# EAGLE design power_node (EAGLE 6.5.0)
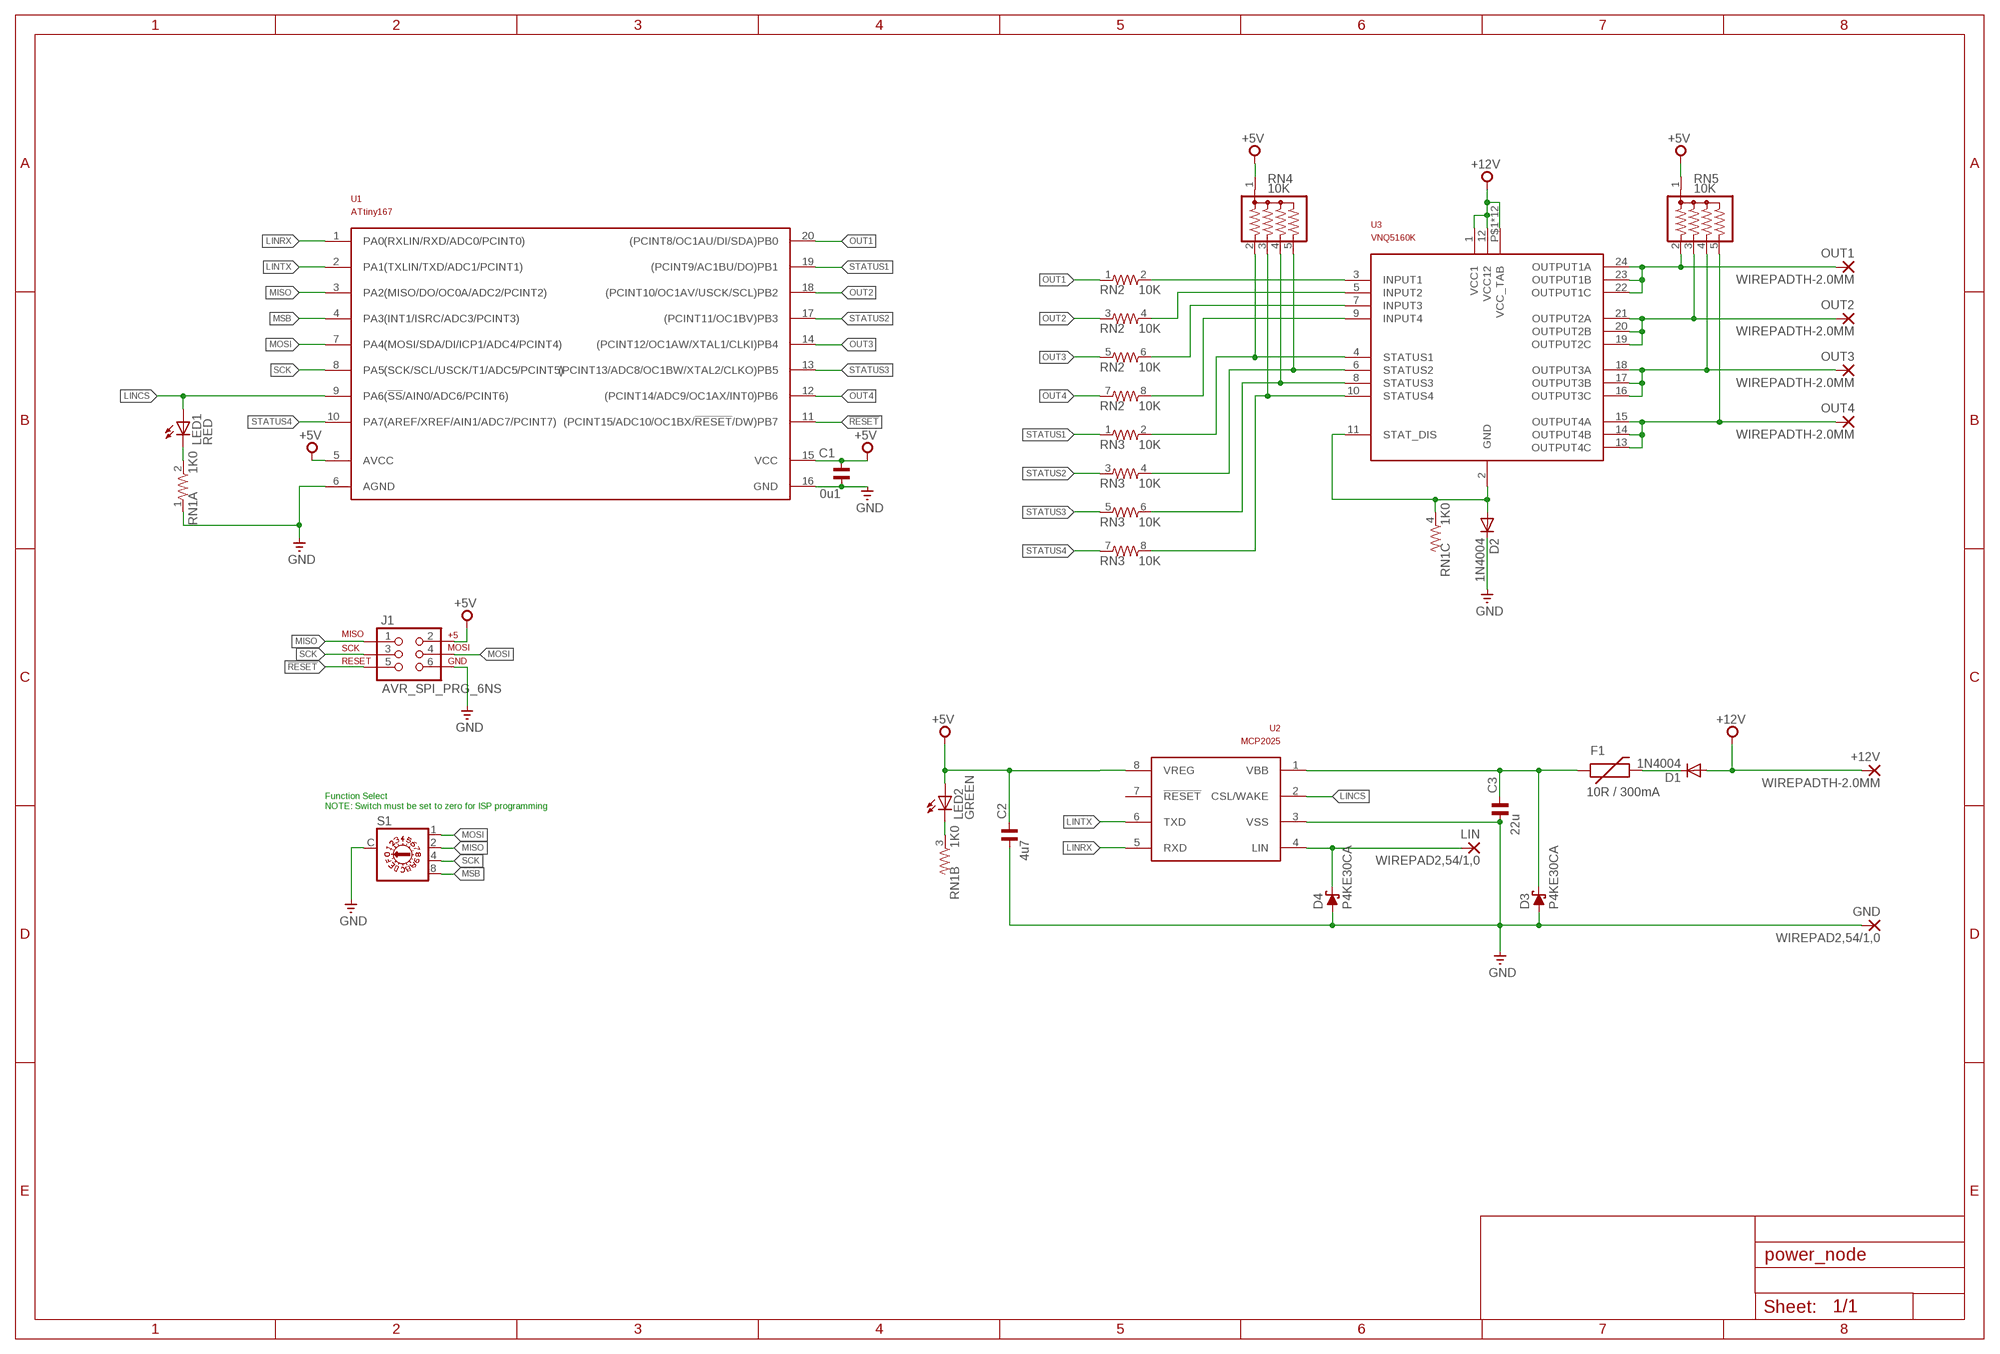
[diagram p0: schematic, sheet 1]

## Parts
+12V  WIREPADTH-2.0MM  [WIREPAD-TH-2.0MM]
C1  0u1  C-EU025-024X044  [C025-024X044]
C2  4u7  C-EU050-024X044  [C050-024X044]
C3  22u  C-EU050-024X044  [C050-024X044]
D1  1N4004  [DO41-10]
D2  1N4004  [DO41-10]
D3  P4KE30CA  P4KEXX  [DO41-10]
D4  P4KE30CA  P4KEXX  [DO41-10]
F1  10R / 300mA  PTCPTH  [PTC]
GND  WIREPAD2,54/1,0  [2,54/1,0]
J1  AVR_SPI_PRG_6NS  [2X3-NS]
LED1  RED  LED3MM  [LED3MM]
LED2  GREEN  LED3MM  [LED3MM]
LIN  WIREPAD2,54/1,0  [2,54/1,0]
OUT1  WIREPADTH-2.0MM  [WIREPAD-TH-2.0MM]
OUT2  WIREPADTH-2.0MM  [WIREPAD-TH-2.0MM]
OUT3  WIREPADTH-2.0MM  [WIREPAD-TH-2.0MM]
OUT4  WIREPADTH-2.0MM  [WIREPAD-TH-2.0MM]
RN1  1K0  GE03R  [SIL4]
RN2  10K  E4RP  [SIL8]
RN3  10K  E4RP  [SIL8]
RN4  10K  G04R  [SIL5]
RN5  10K  G04R  [SIL5]
S1  P103  [P103]
U1  ATtiny167  ATTINY167  [SO20W]
U2  MCP2025  [SO08]
U3  VNQ5160K  [POWERSSO24]

## Nets
!RESET: J1.5 U1.11((PCINT15/ADC10/OC1BX/!RESET!/DW)PB7)
+5V [power]: C1.1 C2.1 J1.2 LED2.A RN4.1 RN5.1 U1.5(AVCC) U1.15(VCC) U2.8(VREG)
+12V [power]: +12V.1(P) D1.A U3.1(VCC1) U3.12(VCC12) U3.P$1(VCC_TAB) U3.P$2(VCC_TAB) U3.P$3(VCC_TAB) U3.P$4(VCC_TAB) U3.P$5(VCC_TAB) U3.P$6(VCC_TAB) U3.P$7(VCC_TAB) U3.P$8(VCC_TAB) U3.P$9(VCC_TAB) U3.P$10(VCC_TAB) U3.P$11(VCC_TAB) U3.P$12(VCC_TAB)
GND [power]: C1.2 C2.2 C3.2 D2.C D3.A D4.A GND.1(P) J1.6 RN1.1 S1.C U1.6(AGND) U1.16(GND) U2.3(VSS)
LINCS: LED1.A U1.9(PA6(!SS!/AIN0/ADC6/PCINT6)) U2.2(CSL/WAKE)
LINRX: U1.1(PA0(RXLIN/RXD/ADC0/PCINT0)) U2.5(RXD)
LINTX: U1.2(PA1(TXLIN/TXD/ADC1/PCINT1)) U2.6(TXD)
MISO: J1.1 S1.2 U1.3(PA2(MISO/DO/OC0A/ADC2/PCINT2))
MOSI: J1.4 S1.1 U1.7(PA4(MOSI/SDA/DI/ICP1/ADC4/PCINT4))
MSB: S1.8 U1.4(PA3(INT1/ISRC/ADC3/PCINT3))
N$1: D4.C LIN.1(P) U2.4(LIN)
N$2 [power]: C3.1 D3.C F1.P$1 U2.1(VBB)
N$3: LED1.K(C) RN1.2
N$4: LED2.K(C) RN1.3
N$5 [power]: D1.C F1.P$2
N$6: RN3.8 RN4.3 U3.10(STATUS4)
N$7: RN3.6 RN4.4 U3.8(STATUS3)
N$8 [power]: D2.A RN1.4 U3.2(GND) U3.11(STAT_DIS)
N$9: RN3.4 RN4.5 U3.6(STATUS2)
N$10: RN3.2 RN4.2 U3.4(STATUS1)
N$11: RN2.2 U3.3(INPUT1)
N$12: RN2.8 U3.9(INPUT4)
N$13: RN2.6 U3.7(INPUT3)
N$14: RN2.4 U3.5(INPUT2)
OUT1: RN2.1 U1.20((PCINT8/OC1AU/DI/SDA)PB0)
OUT2: RN2.3 U1.18((PCINT10/OC1AV/USCK/SCL)PB2)
OUT3: RN2.5 U1.14((PCINT12/OC1AW/XTAL1/CLKI)PB4)
OUT4: RN2.7 U1.12((PCINT14/ADC9/OC1AX/INT0)PB6)
OUTPUT1: OUT1.1(P) RN5.2 U3.22(OUTPUT1C) U3.23(OUTPUT1B) U3.24(OUTPUT1A)
OUTPUT2: OUT2.1(P) RN5.3 U3.19(OUTPUT2C) U3.20(OUTPUT2B) U3.21(OUTPUT2A)
OUTPUT3: OUT3.1(P) RN5.4 U3.16(OUTPUT3C) U3.17(OUTPUT3B) U3.18(OUTPUT3A)
OUTPUT4: OUT4.1(P) RN5.5 U3.13(OUTPUT4C) U3.14(OUTPUT4B) U3.15(OUTPUT4A)
SCK: J1.3 S1.4 U1.8(PA5(SCK/SCL/USCK/T1/ADC5/PCINT5))
STATUS1: RN3.1 U1.19((PCINT9/AC1BU/DO)PB1)
STATUS2: RN3.3 U1.17((PCINT11/OC1BV)PB3)
STATUS3: RN3.5 U1.13((PCINT13/ADC8/OC1BW/XTAL2/CLKO)PB5)
STATUS4: RN3.7 U1.10(PA7(AREF/XREF/AIN1/ADC7/PCINT7))
Unconnected: U2.7(!RESET)

## Notes on the sheet
- Function Select
  NOTE: Switch must be set to zero for ISP programming

## Library data of the parts
+12V GND LIN OUT1-OUT4 = custom:WIREPAD: Wire PAD connect wire on PCB
C1 = custom:C-EU: CAPACITOR, European symbol; PARTNO: FK28X7R1H104K
C2 = custom:C-EU: CAPACITOR, European symbol; PARTNO: FK28X5R0J475K
C3 = custom:C-EU: CAPACITOR, European symbol; PARTNO: FK22X5R1E226M
D1 D2 = custom:1N4004: DIODE general purpose rectifier, 1 A; PARTNO: 1N4004-TP
D3 D4 = custom:P4KEXX: DIODE transient-voltage suppressor; PARTNO: P4KE30CA
F1 = custom:PTC: Resettable Fuse PTC Resettable Fuse. Spark Fun Electronics SKU : COM-08357; PARTNO: 600R150-RBZR
J1 = custom:AVR_SPI_PRG_6: AVR ISP 6 Pin This is the reduced ISP connector for AVR programming. Common on Arduino. This footprint will take up less PCB space and can be used with a 10-pin to 6-pin adapter such as SKU: BOB-08508
LED1 = custom:LED: LEDs Standard schematic elements and footprints for 5mm, 3mm, 1206, and 0603 sized LEDs. 5mm - Spark Fun Electronics SKU : COM-00529 (and others); PARTNO: C4SMF-RJS-CT0W0BB2
LED2 = custom:LED: LEDs Standard schematic elements and footprints for 5mm, 3mm, 1206, and 0603 sized LEDs. 5mm - Spark Fun Electronics SKU : COM-00529 (and others); PARTNO: C4SMF-GJS-CV0Y0792
RN1 = custom:GE03R: SIL RESISTOR; PARTNO: 4604X-101-103LF
RN2 RN3 = custom:E4RP: SIL RESISTOR; PARTNO: 4608X-102-103LF
RN4 RN5 = custom:G04R: SIL RESISTOR; PARTNO: 4605X-101-103LF
S1 = custom:P103: DIL/CODE SWITCH; PARTNO: SH-7050MC
U1 = custom:ATTINY167; PARTNO: ATTINY167-SU
U2 = custom:MCP2025: LIN Transceiver with Voltage Regulator; PARTNO: MCP2025-500E/SN
U3 = custom:VNQ5160K: Quad channel high side driver for automotive applications; PARTNO: VNQ5E160KTR-E

## Net classes
0 default: width 0.381 mm
1 power: width 0.635 mm

## Board
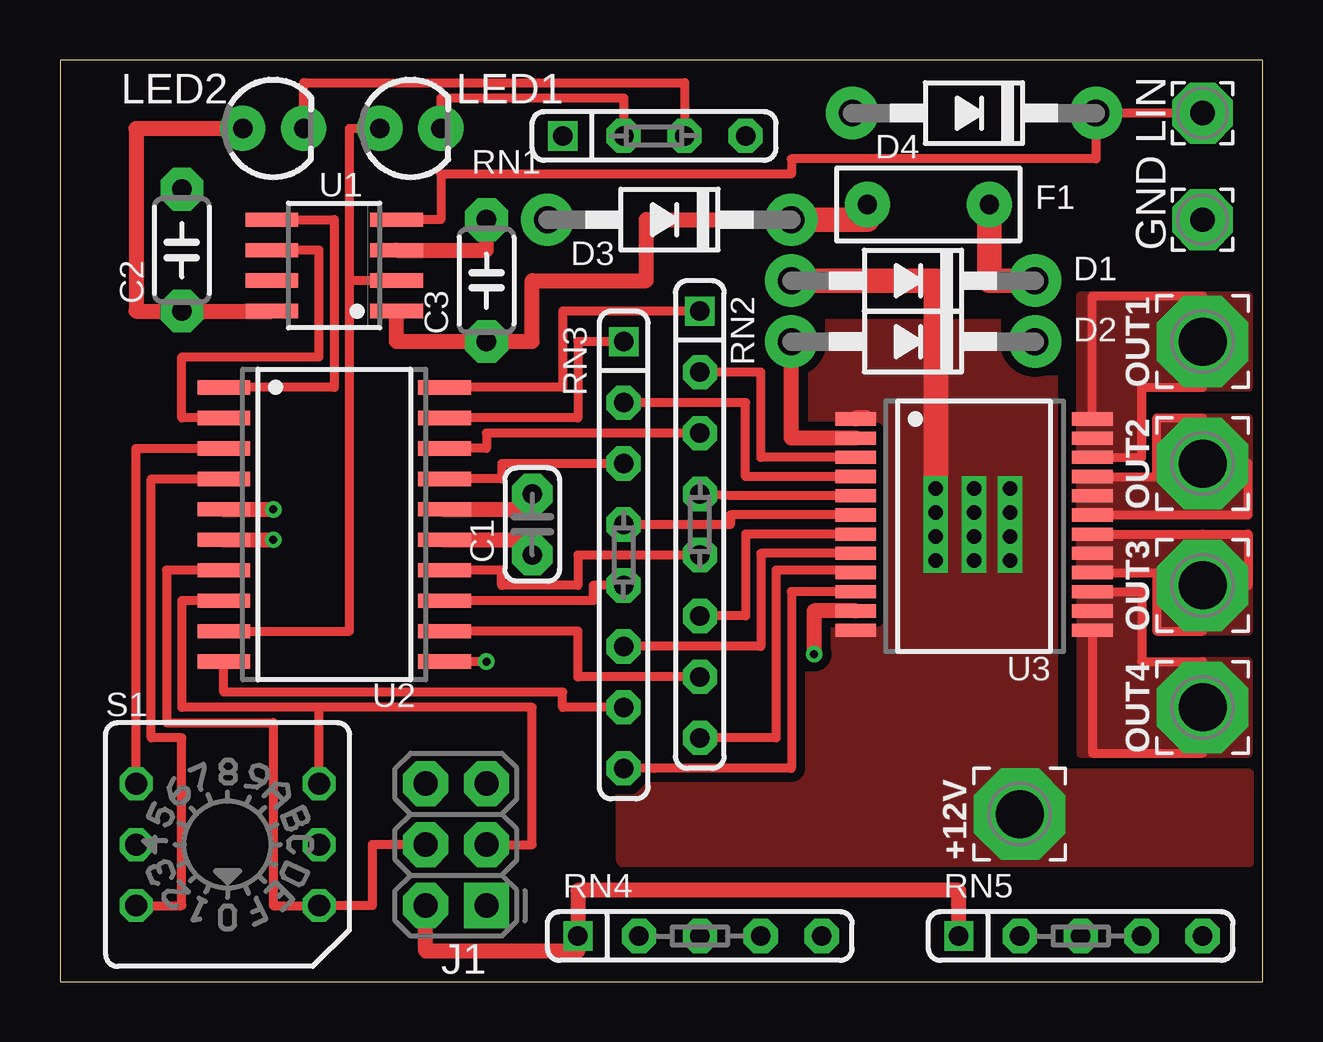
[diagram p1: board, top side]
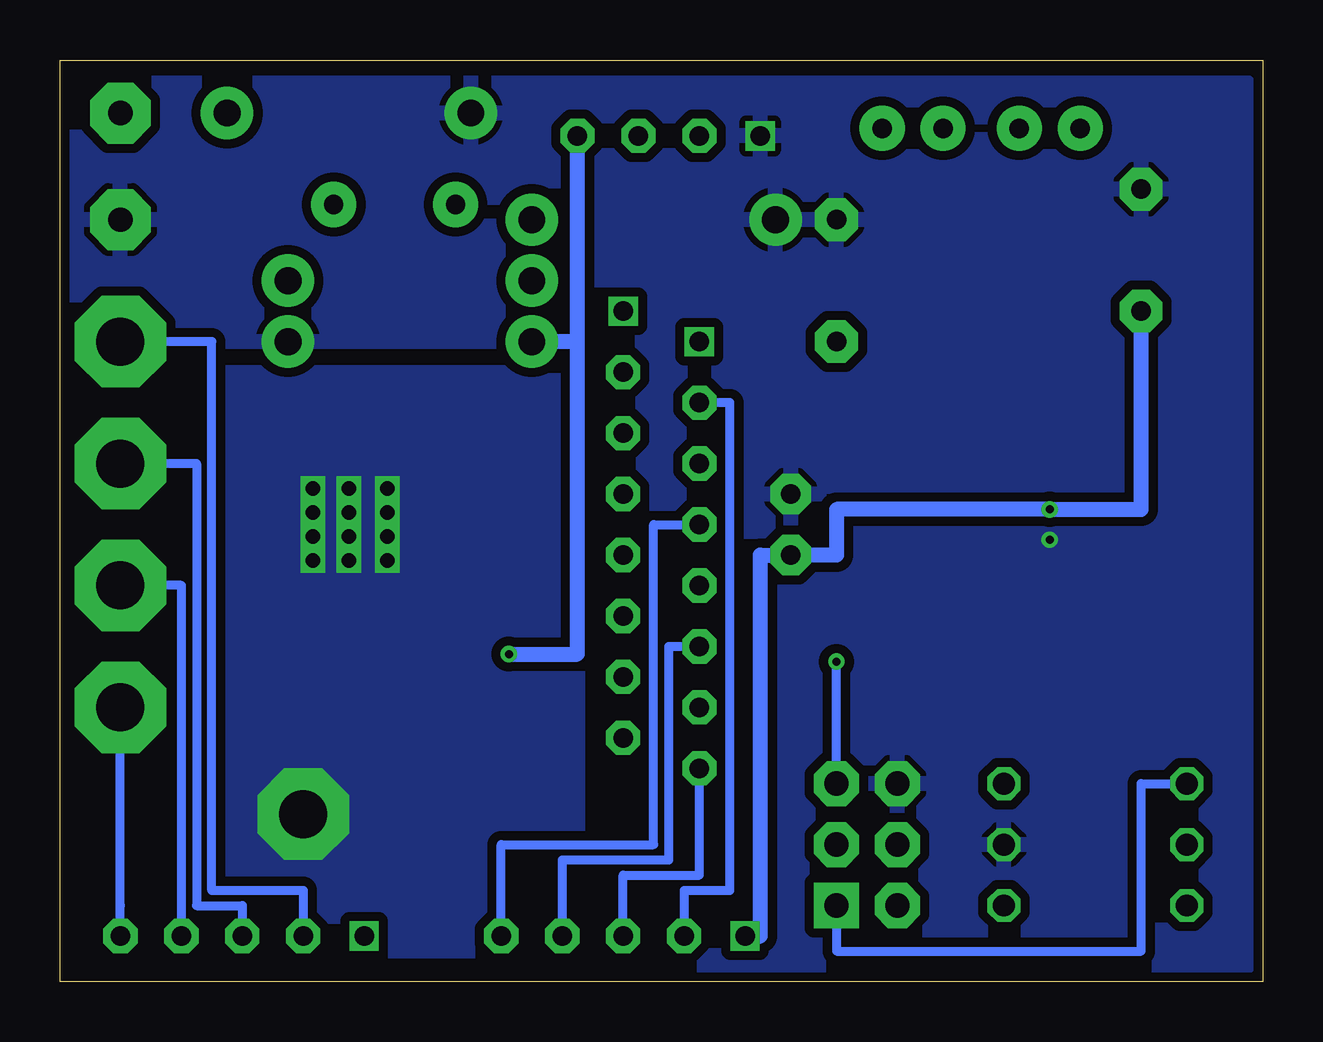
[diagram p2: board, bottom side, seen from below]

Size 50.15 x 38.41 mm. Coordinates in mm from the lower left corner, seen from the top.
Outline: 0,0 50.15,0 50.15,38.41 0,38.41 0,0
Copper layers (1*16): Top 0.0356mm / dielectric 1.5011mm / Bottom 0.0356mm
Design rules "LaenPCBOrder": minimum track width 6mil, minimum drill 13mil, track to track 6mil, track to pad 6mil, pad to pad 6mil, via to via 6mil, smd to smd 6mil, copper to edge 15mil, drill to drill 6mil, minimum pad ring 7mil, minimum via ring 7mil, stop-mask expansion 3mil, vias tented up to drill 0mil, thermal gap 10mil

### Footprints (pad centres in the part's own frame; a part is rotated, then mirrored left to right if it is on the bottom)
WIREPAD-TH-2.0MM = drill 2 pad 3.81 octagon: 1 0,0
C025-024X044 = drill 0.813 pad 1.676 octagon: 1 -1.27,0; 2 1.27,0
C050-024X044 = drill 0.813 pad 1.778 octagon: 1 -2.54,0; 2 2.54,0
DO41-10 = drill 1.118 pad 2.184: A 5.08,0; C -5.08,0
PTC = drill 0.8 pad 1.88: P$1 -2.54,0; P$2 2.54,0
2,54/1,0 = drill 1.016 pad 2.54 octagon: 1 0,0
2X3-NS = drill 1.016 pad 1.88 square: 1 -2.54,-1.27 | drill 1.016 pad 1.88 octagon: 2 -2.54,1.27; 3 0,-1.27; 4 0,1.27; 5 2.54,-1.27; 6 2.54,1.27
LED3MM = drill 0.813 pad 1.88: A -1.27,0; K 1.27,0
SIL4 = drill 0.813 square: 1 -3.81,0 | drill 0.813 pad 1.422 octagon: 2 -1.27,0; 3 1.27,0; 4 3.81,0
SIL8 = drill 0.813 square: 1 -8.89,0 | drill 0.813 pad 1.422 octagon: 2 -6.35,0; 3 -3.81,0; 4 -1.27,0; 5 1.27,0; 6 3.81,0; 7 6.35,0; 8 8.89,0
SIL5 = drill 0.813 square: 1 -5.08,0 | drill 0.813 pad 1.422 octagon: 2 -2.54,0; 3 0,0; 4 2.54,0; 5 5.08,0
P103 = drill 0.914 octagon: 1 3.81,-2.54; 2 -3.81,2.54; 4 3.81,2.54; 8 -3.81,-2.54; C 3.81,0; C1 -3.81,0
SO20W = smd 0.6 x 2.2: 1 -5.715,-4.6; 2 -4.445,-4.6; 3 -3.175,-4.6; 4 -1.905,-4.6; 5 -0.635,-4.6; 6 0.635,-4.6; 7 1.905,-4.6; 8 3.175,-4.6; 9 4.445,-4.6; 10 5.715,-4.6; 11 5.715,4.6; 12 4.445,4.6; 13 3.175,4.6; 14 1.905,4.6; 15 0.635,4.6; 16 -0.635,4.6; 17 -1.905,4.6; 18 -3.175,4.6; 19 -4.445,4.6; 20 -5.715,4.6
SO08 = smd 0.6 x 2.2: 1 -1.905,-2.6; 2 -0.635,-2.6; 3 0.635,-2.6; 4 1.905,-2.6; 5 1.905,2.6; 6 0.635,2.6; 7 -0.635,2.6; 8 -1.905,2.6
POWERSSO24 = smd 0.55 x 1.7: 1 -4.4,-4.933; 2 -3.6,-4.933; 3 -2.8,-4.933; 4 -2,-4.933; 5 -1.2,-4.933; 6 -0.4,-4.933; 7 0.4,-4.933; 8 1.2,-4.933; 9 2,-4.933; 10 2.8,-4.933; 11 3.6,-4.933; 12 4.4,-4.933; 13 4.4,4.933; 14 3.6,4.933; 15 2.8,4.933; 16 2,4.933; 17 1.2,4.933; 18 0.4,4.933; 19 -0.4,4.933; 20 -1.2,4.933; 21 -2,4.933; 22 -2.8,4.933; 23 -3.6,4.933; 24 -4.4,4.933 | drill 0.61 pad 1.016 square: P$1 -0.5,0; P$2 -1.5,0; P$3 0.5,0; P$4 1.5,0; P$5 1.5,1.5; P$6 0.5,1.5; P$7 -0.5,1.5; P$8 -1.5,1.5; P$9 -1.5,-1.6; P$10 -0.5,-1.6; P$11 0.5,-1.6; P$12 1.5,-1.6

### Placement (x,y rotation side)
+12V  40.01,6.99 90 top
C1  19.68,19.05 90 top
C2  5.08,30.48 90 top
C3  17.78,29.21 90 top
D1  35.56,29.21 180 top
D2  35.56,26.67 180 top
D3  25.4,31.75 180 top
D4  38.1,36.2 180 top
F1  36.2,32.38 0 top
GND  47.62,31.75 90 top
J1  16.51,5.71 90 top
LED1  14.61,35.56 0 top
LED2  8.89,35.56 0 top
LIN  47.62,36.2 90 top
OUT1  47.62,26.67 90 top
OUT2  47.62,21.59 90 top
OUT3  47.62,16.51 90 top
OUT4  47.62,11.43 90 top
RN1  24.77,35.24 0 top
RN2  26.67,19.05 270 top
RN3  23.5,17.78 270 top
RN4  26.67,1.91 0 top
RN5  42.55,1.91 0 top
S1  6.99,5.71 0 top
U1  11.43,19.05 270 top
U2  11.43,29.84 90 top
U3  38.1,19.05 270 top

### Tracks (layer width: path | path; a pad name or v marks a point on that pad's centre or on a via)
!RESET  (via drill 0.33)
  Top 0.381: v17.78,13.34 U1.11
  Bottom 0.381: J1.5 v17.78,13.34
+5V  (via drill 0.33)
  Top 0.635: U1.15 19.68,18.41 C1.1 | J1.2 15.24,1.27 21.59,1.27 RN4.1 21.59,3.81 37.47,3.81 RN5.1 | U2.8 C2.1 3.17,27.94 3.17,35.56 LED2.A | U1.5 v8.89,19.68
  Bottom 0.635: RN4.1 20.95,1.91 20.95,17.78 C1.1 17.78,17.78 17.78,19.68 v8.89,19.68 5.08,19.68 C2.1
+12V
  Top 0.635: 33.66,23.5 33.17,23.5 U3.1
  Top 1.016: D1.A 36.5,29.21 U3.P$9
  pour Top (isolate 0.381, no thermals): 49.53,5.08 23.5,5.08 23.5,27.3 41.27,27.3 41.27,8.57 49.53,8.57
  pour Bottom (isolate 0.381, no thermals): 43.18,1.27 43.18,25.4 28.57,25.4 28.57,1.27
GND  (via drill 0.33)
  Top 0.635: U1.16 19.68,19.68 C1.2 | U2.3 17.78,30.48 C3.2 | U1.6 v8.89,18.41
  pour Bottom (isolate 0.381): 49.53,26.67 49.53,37.47 0.64,37.47 0.64,0.64 27.3,0.64 27.3,26.67
LINCS
  Top 0.381: U1.9 12.06,14.61 12.06,29.21 | 12.06,29.21 12.06,35.56 LED1.A | U2.2 12.06,29.21
LINRX
  Top 0.381: U2.5 11.43,31.75 11.43,24.77 U1.1
LINTX
  Top 0.381: U1.2 5.08,23.5 5.08,26.04 10.79,26.04 10.79,30.48 U2.6
MISO
  Top 0.381: S1.2 3.17,22.23 U1.3
  Bottom 0.381: J1.1 17.78,1.27 5.08,1.27 5.08,8.26 S1.2
MOSI
  Top 0.381: J1.4 13.02,5.71 13.02,3.17 S1.1 8.89,3.17 8.89,10.79 4.45,10.79 4.45,17.14 U1.7
MSB
  Top 0.381: S1.8 5.08,3.17 5.08,10.16 3.81,10.16 3.81,20.95 U1.4
N$1
  Top 0.381: U2.4 15.88,31.75 15.88,33.66 30.48,33.66 30.48,34.29 43.18,34.29 D4.C LIN.1
N$2
  Top 0.635: U2.1 14.03,26.67 C3.1 19.68,26.67 19.68,29.21 24.45,29.21 24.45,31.75 D3.C
  Top 1.016: F1.P$1 33.66,31.75 D3.C
N$3
  Top 0.381: LED1.K 15.88,36.83 23.5,36.83 RN1.2
N$4
  Top 0.381: LED2.K 10.16,37.47 26.04,37.47 RN1.3
N$5
  Top 1.016: D1.C 38.73,29.21 F1.P$2
N$6
  Top 0.381: U3.10 30.48,16.25 30.48,8.89 24.77,8.89 RN3.8
  Bottom 0.381: RN4.3 26.67,4.45 23.5,4.45 RN3.8
N$7
  Top 0.381: U3.8 29.21,17.85 29.21,13.97 RN3.6
  Bottom 0.381: RN3.6 24.77,13.97 24.77,5.08 29.21,5.08 RN4.4
N$8  (via drill 0.33)
  Top 0.635: U3.2 31.43,22.65 30.48,22.65 D2.A | U3.11 31.43,15.45 v31.43,13.65
  Bottom 0.635: v31.43,13.65 28.57,13.65 28.57,26.67 | 28.57,26.67 D2.A | 28.57,26.67 RN1.4
N$9
  Top 0.381: U3.6 27.94,19.45 27.94,19.05 RN3.4
  Bottom 0.381: RN4.5 31.75,5.71 25.4,5.71 25.4,19.05 RN3.4
N$10
  Top 0.381: U3.4 28.57,21.05 28.57,24.13 RN3.2
  Bottom 0.381: RN3.2 22.23,24.13 22.23,3.81 24.13,3.81 RN4.2
N$11
  Top 0.381: U3.3 29.21,21.85 29.21,25.4 RN2.2
N$12
  Top 0.381: U3.9 33.17,17.14 29.84,17.14 29.84,10.16 RN2.8
N$13
  Top 0.381: U3.7 28.57,18.65 28.57,15.24 RN2.6
N$14
  Top 0.381: U3.5 27.94,20.25 RN2.4
OUT1
  Top 0.381: RN2.1 20.95,27.94 20.95,24.77 U1.20
OUT2
  Top 0.381: RN2.3 17.78,22.86 17.78,22.23 U1.18
OUT3
  Top 0.381: RN2.5 21.59,17.78 21.59,16.51 18.41,16.51 18.41,17.14 U1.14
OUT4
  Top 0.381: RN2.7 21.59,12.7 21.59,14.61 U1.12
OUTPUT1
  Top 0.381: U3.22 45.09,21.85 45.09,24.77 47.62,24.77 OUT1.1 47.62,28.57 43.03,28.57 U3.24
  Bottom 0.381: OUT1.1 43.81,26.67 43.81,3.81 40.01,3.81 RN5.2
  pour Top (no thermals): 42.55,22.23 42.55,28.57 49.53,28.57 49.53,24.77 45.09,24.77 45.09,22.23
OUTPUT2
  Top 0.381: U3.19 47.62,19.45 49.53,19.45 49.53,19.68 49.53,21.59 OUT2.1 47.62,23.5 45.72,23.5 45.72,21.05 U3.21
  Bottom 0.381: OUT2.1 44.45,21.59 44.45,3.17 42.55,3.17 RN5.3
  pour Top (no thermals): 42.55,19.68 42.55,20.95 45.72,20.95 45.72,23.5 49.53,23.5 49.53,19.68
OUTPUT3
  Top 0.381: U3.18 47.62,18.65 49.53,18.65 49.53,16.51 OUT3.1 47.62,14.61 45.72,14.61 45.72,17.05 U3.16
  Bottom 0.381: OUT3.1 45.09,16.51 45.09,3.17 RN5.4
  pour Top (no thermals): 42.55,18.41 49.53,18.41 49.53,14.61 45.72,14.61 45.72,17.14 42.55,17.14
OUTPUT4
  Top 0.381: U3.15 45.09,16.25 45.09,13.34 47.62,13.34 OUT4.1 47.62,9.53 43.03,9.53 U3.13
  Bottom 0.381: RN5.5 47.62,3.17 OUT4.1
  pour Top (no thermals): 42.55,15.88 42.55,9.53 49.53,9.53 49.53,13.34 45.09,13.34 45.09,15.88
SCK
  Top 0.381: U1.8 5.08,15.88 5.08,11.43 10.79,11.43 | J1.3 19.68,5.71 19.68,11.43 10.79,11.43 | S1.4 10.79,11.43
STATUS1
  Top 0.381: RN3.1 21.59,26.67 21.59,23.5 U1.19
STATUS2
  Top 0.381: RN3.3 18.41,21.59 18.41,20.95 U1.17
STATUS3
  Top 0.381: RN3.5 22.23,16.51 22.23,15.88 U1.13
STATUS4
  Top 0.381: RN3.7 20.95,11.43 20.95,12.06 6.83,12.06 U1.10